# EAGLE design MOD-v2-3_MOD-Strips (EAGLE 8.3.1)
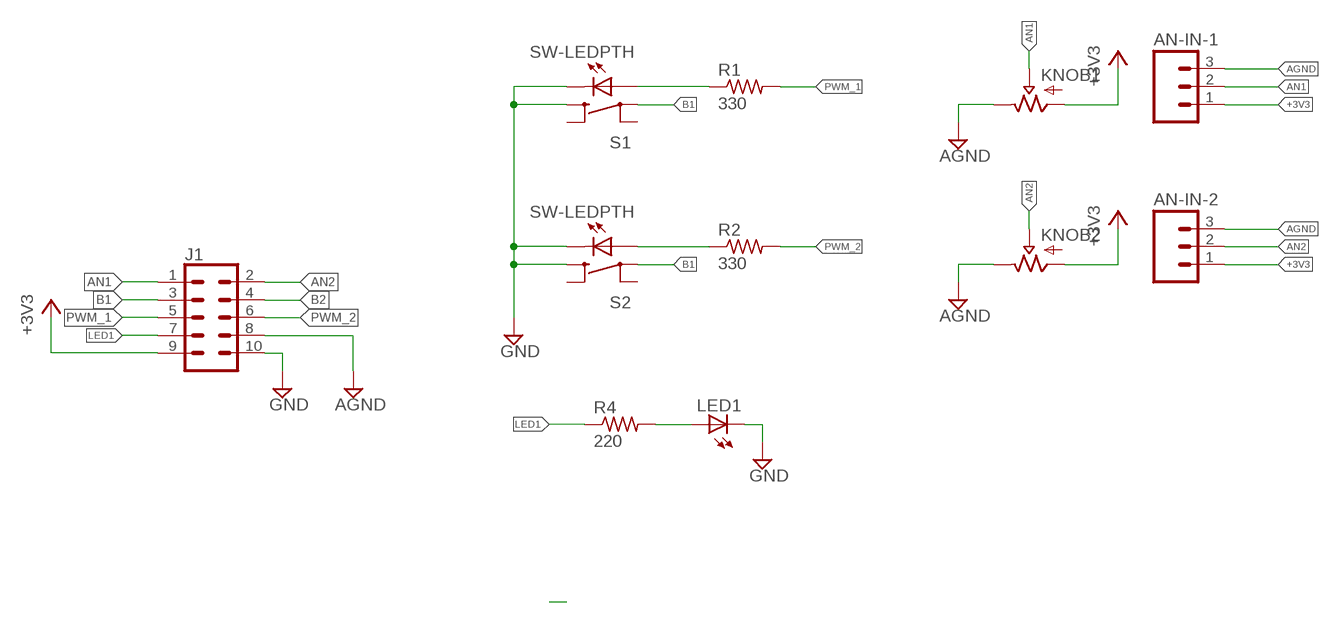
[diagram p0: schematic, sheet 1]

## Parts
AN-IN-1  M031X03_NO_SILK  [1X03_NO_SILK]
AN-IN-2  M031X03_NO_SILK  [1X03_NO_SILK]
J1  CONN_05X2SHD_LOCK  [2X5-SHROUDED_LOCK]
KNOB1  POTALPHA_RD901  [POT_ALPHA_RD901F-40-(L)R1]
KNOB2  POTALPHA_RD901  [POT_ALPHA_RD901F-40-(L)R1]
LED1  LED3MM  [LED3MM]
R1  330  R-US_0204/5  [0204/5]
R2  330  R-US_0204/5  [0204/5]
R4  220  R-US_0204/7  [0204/7]
S1  SW-LEDPTH  [TR2-SWITCH-MOMENTARY-LED]
S2  SW-LEDPTH  [TR2-SWITCH-MOMENTARY-LED]

## Nets
+3V3: AN-IN-1.1 AN-IN-2.1 J1.9 KNOB1.1(IN) KNOB2.1(IN)
AGND [Analog Sig]: AN-IN-1.3 AN-IN-2.3 J1.8 KNOB1.3(OUT) KNOB2.3(OUT)
AN1 [Analog Sig]: AN-IN-1.2 J1.1 KNOB1.2(WIPER)
AN2 [Analog Sig]: AN-IN-2.2 J1.2 KNOB2.2(WIPER)
B1: J1.3 S1.3 S2.3
B2: J1.4
GND: J1.10 LED1.K(C) S1.1 S1.C S2.1 S2.C
LED1: J1.7 R4.1
N1: LED1.A R4.2
N$1: R1.1 S1.A
N$2: R2.1 S2.A
PWM_1: J1.5 R1.2
PWM_2: J1.6 R2.2
Unconnected: S1.2 S1.4 S2.2 S2.4

## Library data of the parts
AN-IN-1 AN-IN-2 = SparkFun-Connectors:M03: Header 3 Standard 3-pin 0.1" header. Use with straight break away headers (SKU : PRT-00116), right angle break away headers (PRT-00553), swiss pins (PRT-00743), machine pins (PRT-00117), and female headers (PRT-00115). Molex polarized connector foot print use with SKU : PRT-08232 with associated crimp pins and housings.
J1 = SparkFun-Connectors:CONN_05X2: Multi connection point. Often used as Generic Header-pin footprint for 0.1 inch spaced/style header connections For AVR SPI programming port, see special device with nice symbol: "AVR_SPI_PROG_5x2.dev" You can populate with any combo of single row headers, but if you'd like an exact match, check these: 2x5 AVR ICSP Male Header <https://www.sparkfun.com/products/778> (PRT-00778) 2x5 Pin Shrouded Header <https://www.sparkfun.com/products/8506> (PRT-08506) On any of the 0.1 inch spaced packages, you can populate with these: Break Away Headers - Straight <https://www.sparkfun.com/products/116> (PRT-00116) Break Away Male Headers - Right Angle <https://www.sparkfun.com/products/553> (PRT-00553) Female Headers <https://www.sparkfun.com/products/115> (PRT-00115) Break Away Headers - Machine Pin <https://www.sparkfun.com/products/117> (PRT-00117) Break Away Female Headers - Swiss Machine Pin <https://www.sparkfun.com/products/743> (PRT-00743) Special note: the shrouded connector mates well with our 5x2 ribbon cables: 2x5 Pin IDC Ribbon Cable <https://www.sparkfun.com/products/8535> (PRT-08535); PROD_ID: CONN-08671; SF_ID: PRT-08506
KNOB1 KNOB2 = CMU-ArtFab:POT: http://www.taydaelectronics.com/10k-ohm-linear-taper-potentiometer-round-shaft-pcb-9mm.html http://www.taydaelectronics.com/datasheets/A-1847.pdf
LED1 = led:LED: LED OSRAM: - CHIPLED LG R971, LG N971, LY N971, LG Q971, LY Q971, LO R971, LY R971 LH N974, LH R974 LS Q976, LO Q976, LY Q976 LO Q996 - Hyper CHIPLED LW Q18S LB Q993, LB Q99A, LB R99A - SideLED LS A670, LO A670, LY A670, LG A670, LP A670 LB A673, LV A673, LT A673, LW A673 LH A674 LY A675 LS A676, LA A676, LO A676, LY A676, LW A676 LS A679, LY A679, LG A679 - Hyper Micro SIDELED® LS Y876, LA Y876, LO Y876, LY Y876 LT Y87S - SmartLED LW L88C, LW L88S LB L89C, LB L89S, LG L890 LS L89K, LO L89K, LY L89K LS L896, LA L896, LO L896, LY L896 - TOPLED LS T670, LO T670, LY T670, LG T670, LP T670 LSG T670, LSP T670, LSY T670, LOP T670, LYG T670 LG T671, LOG T671, LSG T671 LB T673, LV T673, LT T673, LW T673 LH T674 LS T676, LA T676, LO T676, LY T676, LB T676, LH T676, LSB T676, LW T676 LB T67C, LV T67C, LT T67C, LS T67K, LO T67K, LY T67K, LW E67C LS E67B, LA E67B, LO E67B, LY E67B, LB E67C, LV E67C, LT E67C LW T67C LS T679, LY T679, LG T679 LS T770, LO T770, LY T770, LG T770, LP T770 LB T773, LV T773, LT T773, LW T773 LH T774 LS E675, LA E675, LY E675, LS T675 LS T776, LA T776, LO T776, LY T776, LB T776 LHGB T686 LT T68C, LB T68C - Hyper Mini TOPLED® LB M676 - Mini TOPLED Santana® LG M470 LS M47K, LO M47K, LY M47K Source: http://www.osram.convergy.de LUXEON: - LUMILED® LXK2-PW12-R00, LXK2-PW12-S00, LXK2-PW14-U00, LXK2-PW14-V00 LXK2-PM12-R00, LXK2-PM12-S00, LXK2-PM14-U00 LXK2-PE12-Q00, LXK2-PE12-R00, LXK2-PE12-S00, LXK2-PE14-T00, LXK2-PE14-U00 LXK2-PB12-K00, LXK2-PB12-L00, LXK2-PB12-M00, LXK2-PB14-N00, LXK2-PB14-P00, LXK2-PB14-Q00 LXK2-PR12-L00, LXK2-PR12-M00, LXK2-PR14-Q00, LXK2-PR14-R00 LXK2-PD12-Q00, LXK2-PD12-R00, LXK2-PD12-S00 LXK2-PH12-R00, LXK2-PH12-S00 LXK2-PL12-P00, LXK2-PL12-Q00, LXK2-PL12-R00 Source: www.luxeon.com KINGBRIGHT: KA-3528ASYC Source: www.kingbright.com
R1 R2 R4 = CMU-ArtFab:R-US_: RESISTOR, American symbol
S1 S2 = Daniel:SW-LED: SWITCH PUSH SPST-NO 10MA 12V

## Net classes
3 Analog Sig: width 0.381 mm, clearance 0.279 mm

## Board
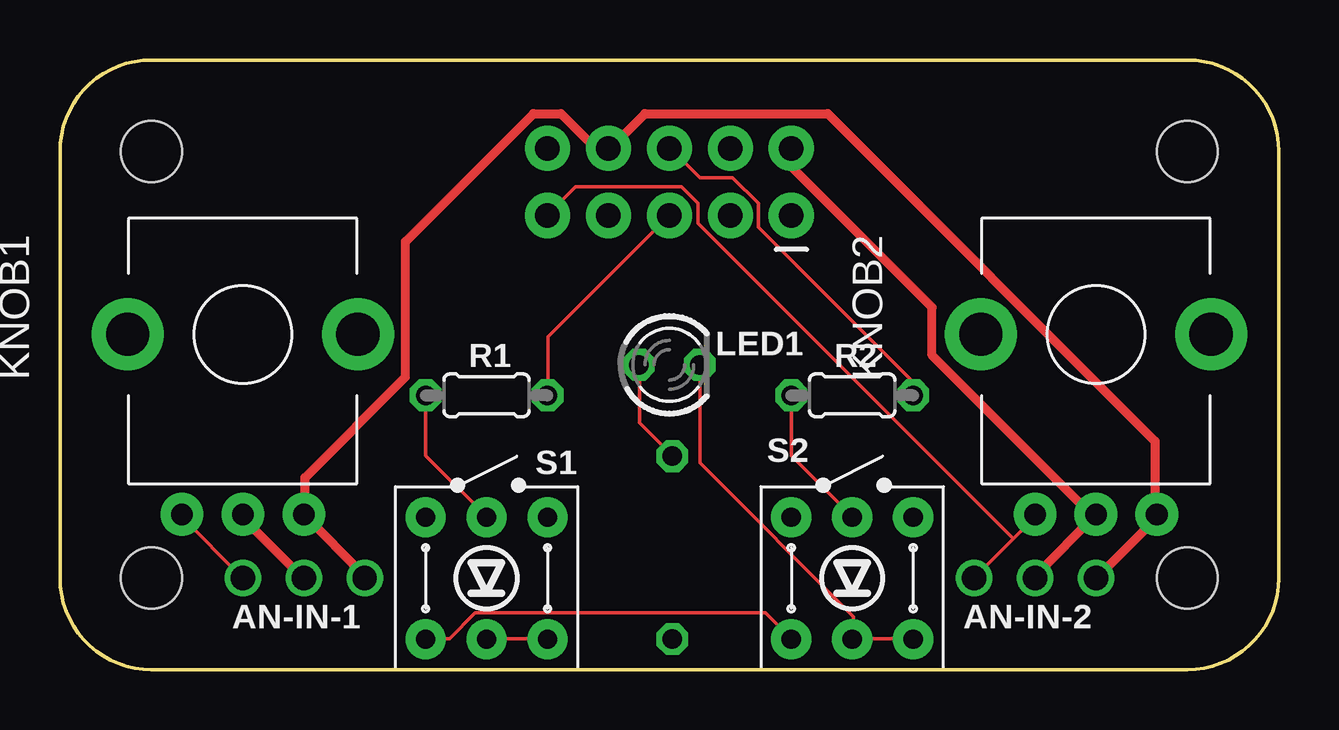
[diagram p1: board, top side]
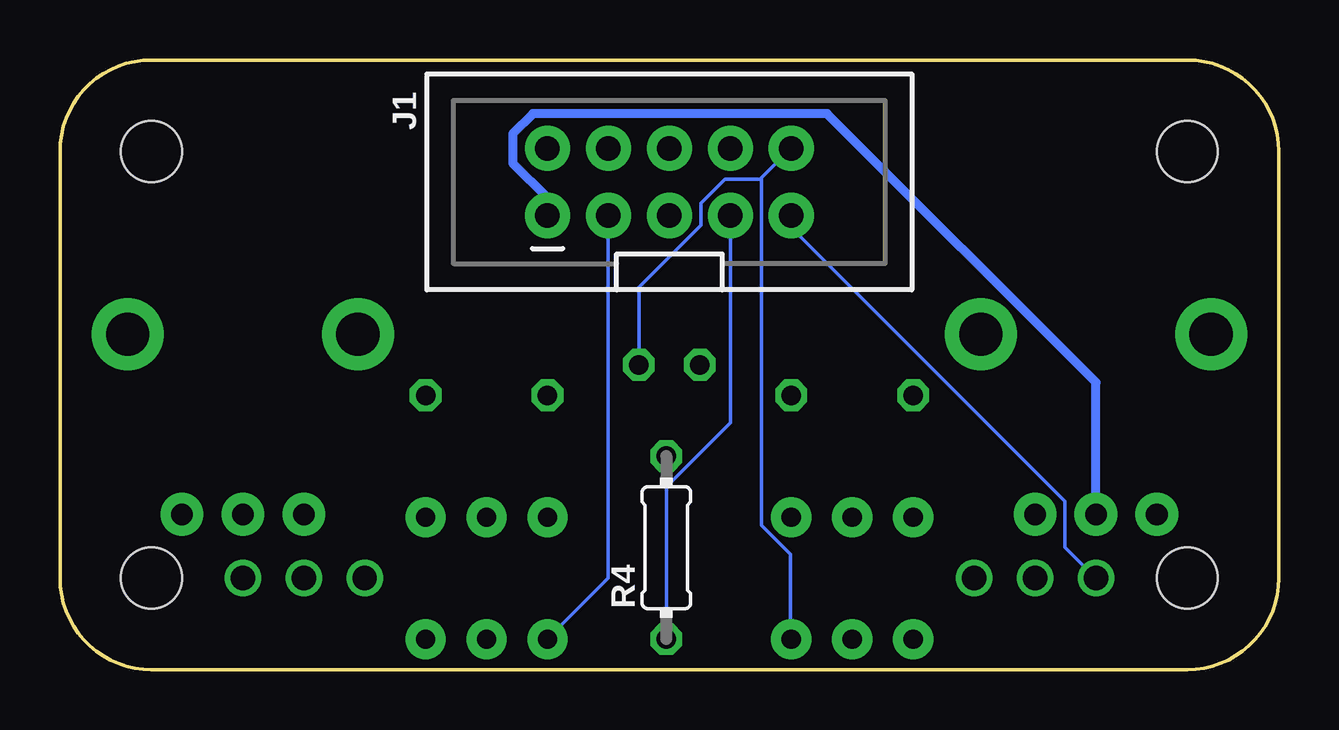
[diagram p2: board, bottom side, seen from below]

Size 50.8 x 25.4 mm. Coordinates in mm from the lower left corner, seen from the top.
Outline: 0,3.81 arc90 3.81,0 46.99,0 arc90 50.8,3.81 50.8,21.59 arc90 46.99,25.4 3.81,25.4 arc90 0,21.59 0,3.81
Copper layers (1*16): Top 0.035mm / dielectric 1.5mm / Bottom 0.035mm
Design rules "default": minimum track width 6mil, minimum drill 0.35mm, track to track 6mil, track to pad 6mil, pad to pad 6mil, via to via 6mil, smd to smd 6mil, copper to edge 40mil, drill to drill 6mil, minimum pad ring 10mil, minimum via ring 8mil, stop-mask expansion 4mil, vias tented up to drill 0mil, thermal gap 10mil
Holes 2.54 mm at 3.81,3.81 46.99,3.81 3.81,21.59 46.99,21.59

### Footprints (pad centres in the part's own frame; a part is rotated, then mirrored left to right if it is on the bottom)
1X03_NO_SILK = drill 1.016 pad 1.524: 1 0,0; 2 2.54,0; 3 5.08,0
2X5-SHROUDED_LOCK = drill 1.016 pad 1.88: 1 -1.397,5.08; 2 1.397,5.08; 3 -1.397,2.54; 4 1.397,2.54; 5 -1.397,0; 6 1.397,0; 7 -1.397,-2.54; 8 1.397,-2.54; 9 -1.397,-5.08; 10 1.397,-5.08
POT_ALPHA_RD901F-40-(L)R1 = drill 0.9 pad 1.778: 1 -2.54,-7.5; 2 0,-7.5; 3 2.54,-7.5 | drill 1.8 pad 3: M1 -4.8,0; M2 4.8,0
LED3MM = drill 0.813 octagon: A -1.27,0; K 1.27,0
0204/5 = drill 0.813 octagon: 1 -2.54,0; 2 2.54,0
0204/7 = drill 0.813 octagon: 1 -3.81,0; 2 3.81,0
TR2-SWITCH-MOMENTARY-LED = drill 0.8 pad 1.676: 1 2.54,-2.54; 2 2.54,2.54; 3 -2.54,-2.54; 4 -2.54,2.54; A 0,2.54; C 0,-2.54

### Placement (x,y rotation side)
AN-IN-1  7.62,3.81 0 top
AN-IN-2  38.1,3.81 0 top
J1  25.4,20.32 90 bottom
KNOB1  7.62,13.97 0 top
KNOB2  43.18,13.97 0 top
LED1  25.4,12.7 0 top
R1  17.78,11.43 0 top
R2  33.02,11.43 0 top
R4  25.53,5.08 90 bottom
S1  17.78,3.81 0 top
S2  33.02,3.81 0 top

### Tracks (layer width: path | path; a pad name or v marks a point on that pad's centre or on a via)
+3V3
  Top 0.152: 39.74,5.45 40.69,6.4 KNOB2.1 | 39.74,5.45 AN-IN-2.1 | AN-IN-1.1 5.03,6.4 KNOB1.1 | 39.74,5.45 26.59,18.59 26.59,19.43 25.91,20.12 21.49,20.12 20.34,18.97 J1.9
  Bottom 0.152: AN-IN-1.1 8.91,5.11 8.91,7.01 20.27,18.36 20.27,18.9 J1.9
AGND
  Top 0.381: AN-IN-2.3 43.2,3.81 45.72,6.33 KNOB2.3 45.64,6.63 45.64,9.53 32,23.16 24.38,23.16 23.01,21.79 J1.8 22.33,21.72 20.88,23.16 19.74,23.16 14.4,17.83 14.4,12.19 10.21,8 10.21,6.63 KNOB1.3 10.21,6.4 12.65,3.96 12.65,3.81 AN-IN-1.3
AN1
  Top 0.381: KNOB1.2 7.62,6.33 10.13,3.81 AN-IN-1.2
  Bottom 0.381: J1.1 30.48,19.66 31.93,21.11 31.93,22.33 31.09,23.16 18.82,23.16 7.62,11.96 KNOB1.2
AN2
  Top 0.381: AN-IN-2.2 40.69,3.81 40.69,3.96 43.13,6.4 KNOB2.2 42.98,6.48 36.35,13.11 36.35,15.09 30.48,20.95 J1.2
B1
  Top 0.152: S1.3 15.24,1.29 16.23,1.29 17.3,2.36 29.41,2.36 30.48,1.29 S2.3
  Bottom 0.152: J1.3 27.96,18.9 27.96,3.81 30.48,1.29 S2.3
GND
  Top 0.152: S2.1 35.51,1.29 33.07,1.29 S2.C 33.07,1.37 33.07,2.21 26.67,8.61 LED1.K | S1.C 17.83,1.29 20.27,1.29 S1.1
  Bottom 0.152: LED1.K 26.67,15.93 24.08,18.52 24.08,19.43 23.09,20.42 21.64,20.42 21.6,20.46 | 21.6,20.46 20.34,21.72 J1.10 | S1.1 20.34,1.29 20.34,4.8 21.57,6.02 21.57,20.42 21.6,20.46
LED1
  Bottom 0.152: R4.1 25.53,7.62 22.86,10.29 J1.7
N1
  Top 0.152: LED1.A 24.16,12.65 24.16,10.29 25.53,8.91 R4.2
N$1
  Top 0.152: R1.1 15.24,8.91 17.75,6.4 S1.A
N$2
  Top 0.152: R2.1 30.48,8.91 32.99,6.4 S2.A
PWM_1
  Top 0.152: J1.5 20.34,13.87 20.34,11.43 R1.2
PWM_2
  Top 0.152: R2.2 35.51,11.43 35.51,12.04 29.11,18.44 29.11,19.43 28.04,20.5 26.67,20.5 25.45,21.72 J1.6